# EAGLE schematic Schematic_of_7_syringe_pump (EAGLE 9.7.0)
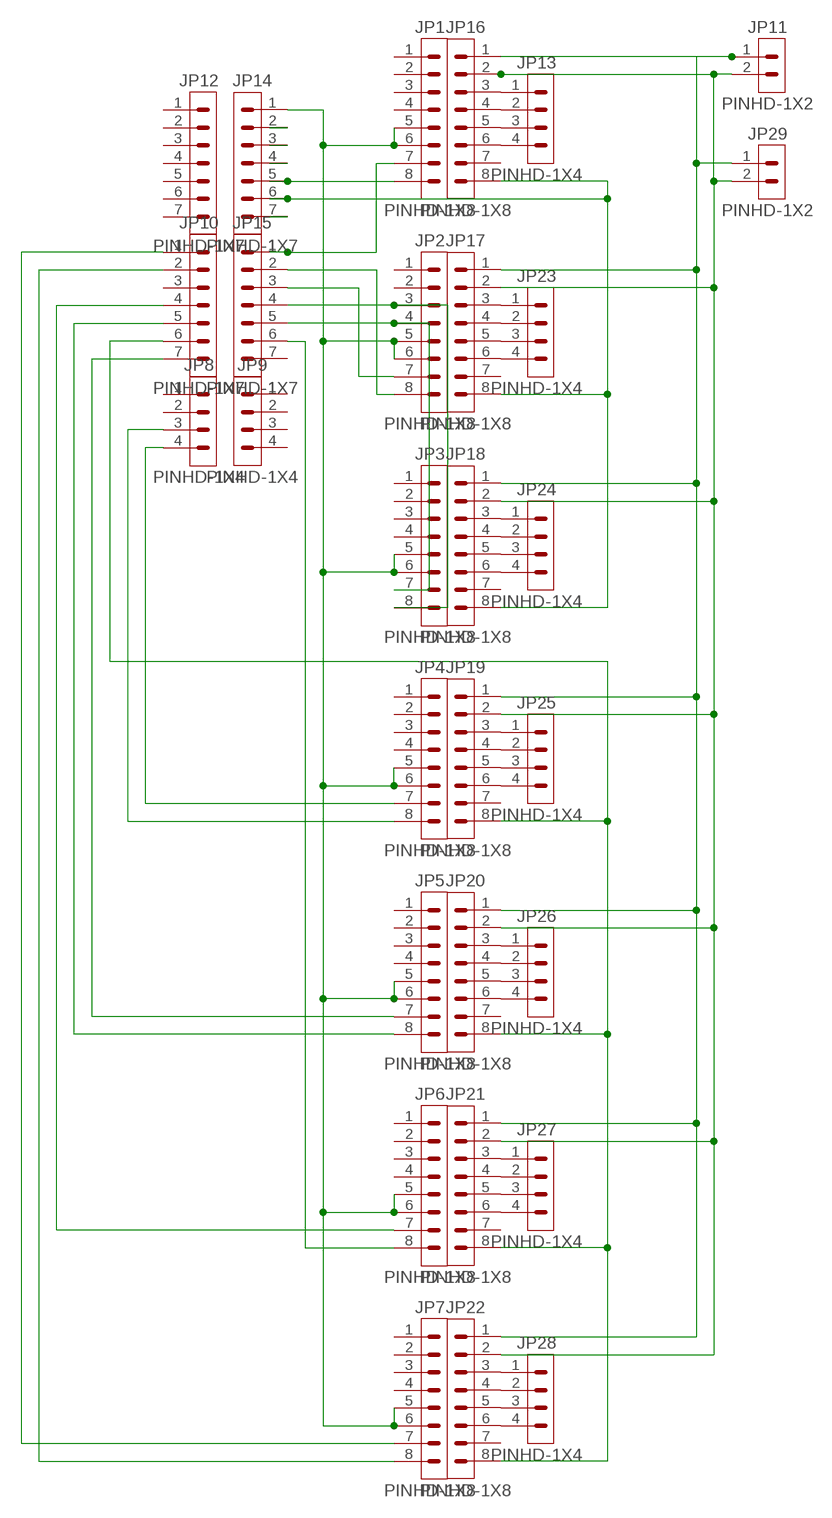
[diagram p0: schematic, sheet 1]

## Parts
JP1  PINHD-1X8  [1X08]
JP2  PINHD-1X8  [1X08]
JP3  PINHD-1X8  [1X08]
JP4  PINHD-1X8  [1X08]
JP5  PINHD-1X8  [1X08]
JP6  PINHD-1X8  [1X08]
JP7  PINHD-1X8  [1X08]
JP8  PINHD-1X4  [1X04]
JP9  PINHD-1X4  [1X04]
JP10  PINHD-1X7  [1X07]
JP11  PINHD-1X2  [1X02]
JP12  PINHD-1X7  [1X07]
JP13  PINHD-1X4  [1X04]
JP14  PINHD-1X7  [1X07]
JP15  PINHD-1X7  [1X07]
JP16  PINHD-1X8  [1X08]
JP17  PINHD-1X8  [1X08]
JP18  PINHD-1X8  [1X08]
JP19  PINHD-1X8  [1X08]
JP20  PINHD-1X8  [1X08]
JP21  PINHD-1X8  [1X08]
JP22  PINHD-1X8  [1X08]
JP23  PINHD-1X4  [1X04]
JP24  PINHD-1X4  [1X04]
JP25  PINHD-1X4  [1X04]
JP26  PINHD-1X4  [1X04]
JP27  PINHD-1X4  [1X04]
JP28  PINHD-1X4  [1X04]
JP29  PINHD-1X2  [1X02]

## Nets
N$1: JP14.4
N$2: JP14.2
N$3: JP14.3
N$4: JP2.8 JP15.2
N$5: JP2.7 JP15.3
N$6: JP14.6 JP16.8 JP17.8 JP18.8
N$7: JP2.3 JP3.8 JP15.4
N$8: JP2.4 JP3.7 JP15.5
N$9: JP6.7 JP10.4
N$10: JP7.8 JP10.2
N$11: JP7.7 JP10.1
N$12: JP5.8 JP10.5
N$13: JP5.7 JP10.7
N$14: JP10.6 JP19.8 JP20.8 JP21.8 JP22.8
N$15: JP6.8 JP15.6
N$16: JP4.8 JP8.3
N$17: JP4.7 JP8.4
N$18: JP18.3 JP24.1
N$19: JP18.4 JP24.2
N$20: JP11.2 JP16.2 JP17.2 JP18.2 JP19.2 JP20.2 JP21.2 JP22.2 JP29.2
N$21: JP11.1 JP16.1 JP17.1 JP18.1 JP19.1 JP20.1 JP21.1 JP22.1 JP29.1
N$22: JP18.5 JP24.3
N$23: JP18.6 JP24.4
N$24: JP17.3 JP23.1
N$25: JP17.4 JP23.2
N$26: JP17.5 JP23.3
N$27: JP17.6 JP23.4
N$28: JP13.1 JP16.3
N$29: JP13.2 JP16.4
N$30: JP13.3 JP16.5
N$31: JP13.4 JP16.6
N$32: JP19.3 JP25.1
N$33: JP19.4 JP25.2
N$34: JP19.5 JP25.3
N$35: JP19.6 JP25.4
N$36: JP20.3 JP26.1
N$37: JP20.4 JP26.2
N$38: JP20.5 JP26.3
N$39: JP20.6 JP26.4
N$40: JP21.3 JP27.1
N$41: JP21.4 JP27.2
N$42: JP21.5 JP27.3
N$43: JP21.6 JP27.4
N$44: JP22.3 JP28.1
N$45: JP22.4 JP28.2
N$46: JP22.5 JP28.3
N$47: JP22.6 JP28.4
N$48: JP1.5 JP1.6 JP2.5 JP2.6 JP3.5 JP3.6 JP4.5 JP4.6 JP5.5 JP5.6 JP6.5 JP6.6 JP7.5 JP7.6 JP14.1
N$49: JP1.8 JP14.5
N$50: JP14.7
N$51: JP1.7 JP15.1
Unconnected: JP1.1 JP1.2 JP1.3 JP1.4 JP2.1 JP2.2 JP3.1 JP3.2 JP3.3 JP3.4 JP4.1 JP4.2 JP4.3 JP4.4 JP5.1 JP5.2 JP5.3 JP5.4 JP6.1 JP6.2 JP6.3 JP6.4 JP7.1 JP7.2 JP7.3 JP7.4 JP8.1 JP8.2 JP9.1 JP9.2 JP9.3 JP9.4 JP10.3 JP12.1 JP12.2 JP12.3 JP12.4 JP12.5 JP12.6 JP12.7 JP15.7 JP16.7 JP17.7 JP18.7 JP19.7 JP20.7 JP21.7 JP22.7

## Library data of the parts
JP1-JP7 JP16-JP22 = Connector:PINHD-1X8: Pin Header; CATEGORY: Connectors; DESCRIPTION: Header-Straight-8 Position; PACKAGE_TYPE: Through Hole; PITCH: 0.100" (2.54mm); SUBCATEGORY: Headers; TYPE: Male Pins
JP8 JP9 JP13 JP23-JP28 = Connector:PINHD-1X4: Pin Header; CATEGORY: Connectors; DESCRIPTION: Header-Straight-4 Position; PACKAGE_TYPE: Through Hole; PITCH: 0.100" (2.54mm); SUBCATEGORY: Headers; TYPE: Male Pins
JP10 JP12 JP14 JP15 = Connector:PINHD-1X7: Pin Header; CATEGORY: Connectors; DESCRIPTION: Header-Straight-7 Position; PACKAGE_TYPE: Through Hole; PITCH: 0.100" (2.54mm); SUBCATEGORY: Headers; TYPE: Male Pins
JP11 JP29 = Connector:PINHD-1X2: Pin Header; CATEGORY: Connectors; DESCRIPTION: Header-Straight-2 Position; PACKAGE_TYPE: Through Hole; PITCH: 0.100" (2.54mm); SUBCATEGORY: Headers; TYPE: Male Pins